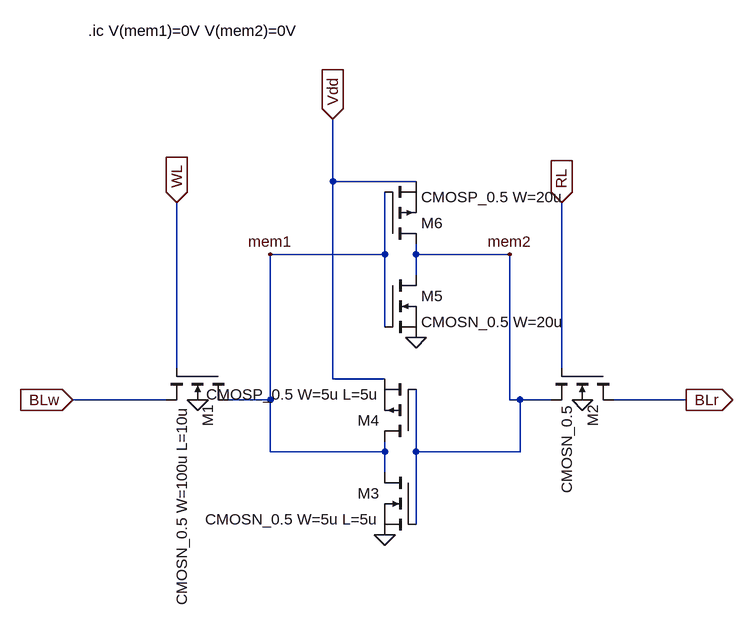
[diagram p0: schematic s_sram_cell.asc]
s_sram_cell.asc, the LTspice schematic file:
Version 4
SHEET 1 880 680
WIRE 48 -240 48 -336
WIRE 176 -240 48 -240
WIRE 128 -128 128 -224
WIRE 128 -128 -48 -128
WIRE 176 -128 176 -144
WIRE 320 -128 176 -128
WIRE 176 -96 176 -128
WIRE 128 -16 128 -128
WIRE -192 48 -192 -208
WIRE 400 48 400 -208
WIRE 48 64 48 -240
WIRE 128 64 48 64
WIRE -208 96 -352 96
WIRE -48 96 -48 -128
WIRE -48 96 -112 96
WIRE 320 96 320 -128
WIRE 336 96 320 96
WIRE 384 96 336 96
WIRE 592 96 480 96
WIRE -48 176 -48 96
WIRE 128 176 128 160
WIRE 128 176 -48 176
WIRE 176 176 176 80
WIRE 336 176 336 96
WIRE 336 176 176 176
WIRE 128 208 128 176
WIRE 176 288 176 176
FLAG -160 96 0
FLAG 432 96 0
FLAG 128 304 0
FLAG -192 -208 WL
IOPIN -192 -208 In
FLAG 400 -208 RL
IOPIN 400 -208 In
FLAG 176 0 0
FLAG 48 -336 Vdd
IOPIN 48 -336 In
FLAG -352 96 BLw
IOPIN -352 96 In
FLAG 592 96 BLr
IOPIN 592 96 Out
FLAG -48 -128 mem1
FLAG 320 -128 mem2
SYMBOL nmos4 -112 48 R90
SYMATTR InstName M1
SYMATTR Value CMOSN_0.5 W=100u L=10u
SYMBOL nmos4 480 48 R90
SYMATTR InstName M2
SYMATTR Value CMOSN_0.5
SYMBOL nmos 176 208 M0
SYMATTR InstName M3
SYMATTR Value CMOSN_0.5 W=5u L=5u
SYMBOL pmos 176 160 R180
SYMATTR InstName M4
SYMATTR Value CMOSP_0.5 W=5u L=5u
SYMBOL nmos 128 -96 R0
SYMATTR InstName M5
SYMATTR Value CMOSN_0.5 W=20u
SYMBOL pmos 128 -144 M180
SYMATTR InstName M6
SYMATTR Value CMOSP_0.5 W=20u
TEXT -328 -472 Left 2 !.ic V(mem1)=0V V(mem2)=0V

The netlist it stands for:
* s_sram_cell.asc
M1 mem1 WL BLw 0 CMOSN_0.5 W=100u L=10u
M2 BLr RL mem2 0 CMOSN_0.5
M3 mem1 mem2 0 0 CMOSN_0.5 W=5u L=5u
M4 mem1 mem2 Vdd Vdd CMOSP_0.5 W=5u L=5u
M5 mem2 mem1 0 0 CMOSN_0.5 W=20u
M6 mem2 mem1 Vdd Vdd CMOSP_0.5 W=20u
.model NMOS NMOS
.model PMOS PMOS
.lib standard.mos
.ic V(mem1)=0V V(mem2)=0V
.backanno
.end